# Altium schematic sheet 0805_C_0.1uf.schdoc
size 49 x 29 mm
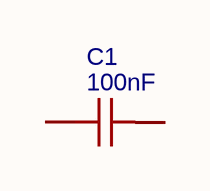
[diagram p0: 0805_C_0.1uf.schdoc]

## Parts
C1  100nF  [C0805]

## Nets

Not connected (* = marked no-connect by the designer): C1 1 2

## Library data of the parts
C1 = 100nF: BOM_Manufacturer: KEMET; BOM_Manufacturer Part: C0805C104K1RECAUTO; nameAlias: Capacitance; Contributor: LCSC; BOM_Supplier: LCSC; BOM_Supplier Part: C696367; spicePre: C; spiceSymbolName: C0805C104K1RECAUTO